# Altium schematic sheet mezza.SchDoc
size A1
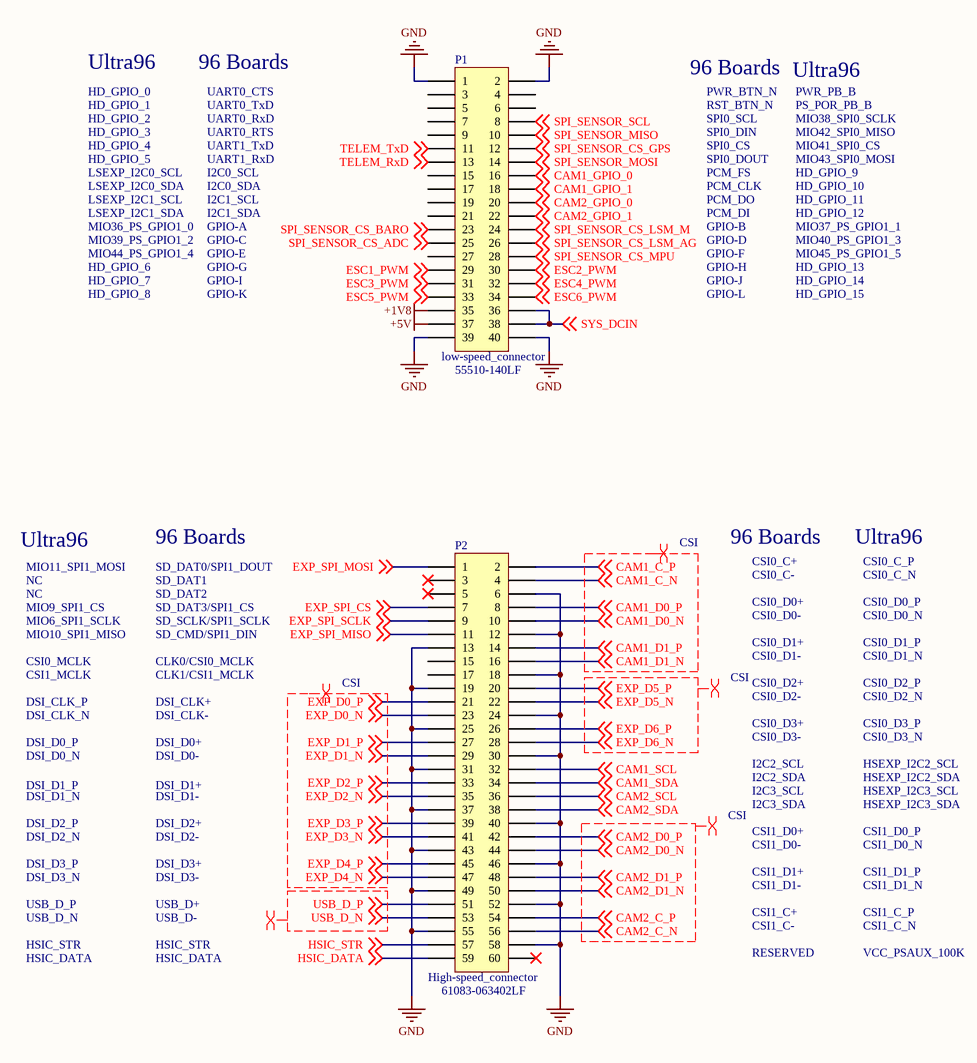
[diagram p0: mezza.SchDoc]

## Parts
P1  low-speed_connector  PartNumber: 55510-140LF  [low-speed_connector_SM]
P2  High-speed_connector  PartNumber: 61083-063402LF  [high-speed_connector]

## Nets
+1V8: P1.35
+5V: P1.37
GND: P1.1 P1.2 P1.39 P1.40 P2.6 P2.12 P2.13 P2.18 P2.19 P2.24 P2.25 P2.30 P2.31 P2.37 P2.40 P2.43 P2.46 P2.49 P2.52 P2.55 P2.58
CAM1_C_N: P2.4 ; off-sheet CAM1_C_N
CAM1_C_P: P2.2 ; off-sheet CAM1_C_P
CAM1_D0_N: P2.10 ; off-sheet CAM1_D0_N
CAM1_D0_P: P2.8 ; off-sheet CAM1_D0_P
CAM1_D1_N: P2.16 ; off-sheet CAM1_D1_N
CAM1_D1_P: P2.14 ; off-sheet CAM1_D1_P
CAM1_GPIO_0: P1.16 ; off-sheet CAM1_GPIO_0
CAM1_GPIO_1: P1.18 ; off-sheet CAM1_GPIO_1
CAM1_SCL: P2.32 ; off-sheet CAM1_SCL
CAM1_SDA: P2.34 ; off-sheet CAM1_SDA
CAM2_C_N: P2.56 ; off-sheet CAM2_C_N
CAM2_C_P: P2.54 ; off-sheet CAM2_C_P
CAM2_D0_N: P2.44 ; off-sheet CAM2_D0_N
CAM2_D0_P: P2.42 ; off-sheet CAM2_D0_P
CAM2_D1_N: P2.50 ; off-sheet CAM2_D1_N
CAM2_D1_P: P2.48 ; off-sheet CAM2_D1_P
CAM2_GPIO_0: P1.20 ; off-sheet CAM2_GPIO_0
CAM2_GPIO_1: P1.22 ; off-sheet CAM2_GPIO_1
CAM2_SCL: P2.36 ; off-sheet CAM2_SCL
CAM2_SDA: P2.38 ; off-sheet CAM2_SDA
ESC1_PWM: P1.29 ; off-sheet ESC1_PWM
ESC2_PWM: P1.30 ; off-sheet ESC2_PWM
ESC3_PWM: P1.31 ; off-sheet ESC3_PWM
ESC4_PWM: P1.32 ; off-sheet ESC4_PWM
ESC5_PWM: P1.33 ; off-sheet ESC5_PWM
ESC6_PWM: P1.34 ; off-sheet ESC6_PWM
EXP_D0_N: P2.23 ; off-sheet EXP_D0_N
EXP_D0_P: P2.21 ; off-sheet EXP_D0_P
EXP_D1_N: P2.29 ; off-sheet EXP_D1_N
EXP_D1_P: P2.27 ; off-sheet EXP_D1_P
EXP_D2_N: P2.35 ; off-sheet EXP_D2_N
EXP_D2_P: P2.33 ; off-sheet EXP_D2_P
EXP_D3_N: P2.41 ; off-sheet EXP_D3_N
EXP_D3_P: P2.39 ; off-sheet EXP_D3_P
EXP_D4_N: P2.47 ; off-sheet EXP_D4_N
EXP_D4_P: P2.45 ; off-sheet EXP_D4_P
EXP_D5_N: P2.22 ; off-sheet EXP_D5_N
EXP_D5_P: P2.20 ; off-sheet EXP_D5_P
EXP_D6_N: P2.28 ; off-sheet EXP_D6_N
EXP_D6_P: P2.26 ; off-sheet EXP_D6_P
EXP_SPI_CS: P2.7 ; off-sheet EXP_SPI_CS
EXP_SPI_MISO: P2.11 ; off-sheet EXP_SPI_MISO
EXP_SPI_MOSI: P2.1 ; off-sheet EXP_SPI_MOSI
EXP_SPI_SCLK: P2.9 ; off-sheet EXP_SPI_SCLK
HSIC_DATA: P2.59 ; off-sheet HSIC_DATA
HSIC_STR: P2.39(57) ; off-sheet HSIC_STR
SPI_SENSOR_CS_ADC: P1.25 ; off-sheet SPI_SENSOR_CS_ADC
SPI_SENSOR_CS_BARO: P1.23 ; off-sheet SPI_SENSOR_CS_BARO
SPI_SENSOR_CS_GPS: P1.12 ; off-sheet SPI_SENSOR_CS_GPS
SPI_SENSOR_CS_LSM_AG: P1.26 ; off-sheet SPI_SENSOR_CS_LSM_AG
SPI_SENSOR_CS_LSM_M: P1.24 ; off-sheet SPI_SENSOR_CS_LSM_M
SPI_SENSOR_CS_MPU: P1.28 ; off-sheet SPI_SENSOR_CS_MPU
SPI_SENSOR_MISO: P1.10 ; off-sheet SPI_SENSOR_MISO
SPI_SENSOR_MOSI: P1.14 ; off-sheet SPI_SENSOR_MOSI
SPI_SENSOR_SCL: P1.8 ; off-sheet SPI_SENSOR_SCL
SYS_DCIN: P1.36 P1.38 ; off-sheet SYS_DCIN
TELEM_RxD: P1.13 ; off-sheet TELEM_RxD
TELEM_TxD: P1.11 ; off-sheet TELEM_TxD
USB_D_N: P2.53 ; off-sheet USB_D_N
USB_D_P: P2.51 ; off-sheet USB_D_P

Not connected (* = marked no-connect by the designer): P1 3 4 5 6 7 9 15 17 19 21 27; P2 3* 5* 15 17

## Layout directives
differential pair; rule Differential Pairs Routing [Pref Gap = 0.15mm    Min Gap  = 0.1mm    Max Gap  = 0.254mmPref Width = 0.15mm    Min Width  = 0.1mm    Max Width  = 0.381mm]; differential pair class CSI: CAM1_C_N, CAM1_C_P, CAM1_D0_N, CAM1_D0_P, CAM1_D1_N, CAM1_D1_P, CAM2_C_N, CAM2_C_P, CAM2_D0_N, CAM2_D0_P, CAM2_D1_N, CAM2_D1_P, EXP_D0_N, EXP_D0_P, EXP_D1_N, EXP_D1_P, EXP_D2_N, EXP_D2_P, EXP_D3_N, EXP_D3_P, EXP_D4_N, EXP_D4_P, EXP_D5_N, EXP_D5_P, EXP_D6_N, EXP_D6_P
differential pair: USB_D_N, USB_D_P

## Notes on the sheet
- Ultra96
- 96 Boards
- HD_GPIO_0
- HD_GPIO_1
- HD_GPIO_2
- HD_GPIO_3
- HD_GPIO_4
- UART0_CTS
- UART0_TxD
- UART0_RxD
- UART0_RTS
- UART1_TxD
- PWR_BTN_N
- RST_BTN_N
- SPI0_SCL
- SPI0_DIN
- SPI0_CS
- PWR_PB_B
- PS_POR_PB_B
- MIO38_SPI0_SCLK
- MIO42_SPI0_MISO
- MIO41_SPI0_CS
- HD_GPIO_5
- LSEXP_I2C0_SCL
- LSEXP_I2C0_SDA
- LSEXP_I2C1_SCL
- LSEXP_I2C1_SDA
- UART1_RxD
- I2C0_SCL
- I2C0_SDA
- I2C1_SCL
- I2C1_SDA
- SPI0_DOUT
- PCM_FS
- PCM_CLK
- PCM_DO
- PCM_DI
- MIO43_SPI0_MOSI
- HD_GPIO_9
- HD_GPIO_10
- HD_GPIO_11
- HD_GPIO_12
- MIO36_PS_GPIO1_0
- MIO39_PS_GPIO1_2
- MIO44_PS_GPIO1_4
- HD_GPIO_6
- HD_GPIO_7
- GPIO-A
- GPIO-C
- GPIO-E
- GPIO-G
- GPIO-I
- GPIO-B
- GPIO-D
- GPIO-F
- GPIO-H
- GPIO-J
- MIO37_PS_GPIO1_1
- MIO40_PS_GPIO1_3
- MIO45_PS_GPIO1_5
- HD_GPIO_13
- HD_GPIO_14
- HD_GPIO_8
- GPIO-K
- GPIO-L
- HD_GPIO_15
- MIO11_SPI1_MOSI
- NC
- MIO9_SPI1_CS
- SD_DAT0/SPI1_DOUT
- SD_DAT1
- SD_DAT2
- SD_DAT3/SPI1_CS
- CSI0_C+
- CSI0_C-
- CSI0_D0+
- CSI0_D0-
- CSI0_C_P
- CSI0_C_N
- CSI0_D0_P
- CSI0_D0_N
- MIO6_SPI1_SCLK
- MIO10_SPI1_MISO
- CSI0_MCLK
- CSI1_MCLK
- SD_SCLK/SPI1_SCLK
- SD_CMD/SPI1_DIN
- CLK0/CSI0_MCLK
- CLK1/CSI1_MCLK
- CSI0_D1+
- CSI0_D1-
- CSI0_D2+
- CSI0_D1_P
- CSI0_D1_N
- CSI0_D2_P
- DSI_CLK_P
- DSI_CLK_N
- DSI_D0_P
- DSI_CLK+
- DSI_CLK-
- DSI_D0+
- CSI0_D2-
- CSI0_D3+
- CSI0_D3-
- CSI0_D2_N
- CSI0_D3_P
- CSI0_D3_N
- DSI_D0_N
- DSI_D1_P
- DSI_D1_N
- DSI_D0-
- DSI_D1+
- DSI_D1-
- I2C2_SCL
- I2C2_SDA
- I2C3_SCL
- I2C3_SDA
- HSEXP_I2C2_SCL
- HSEXP_I2C2_SDA
- HSEXP_I2C3_SCL
- HSEXP_I2C3_SDA
- DSI_D2_P
- DSI_D2_N
- DSI_D3_P
- DSI_D3_N
- DSI_D2+
- DSI_D2-
- DSI_D3+
- DSI_D3-
- CSI1_D0+
- CSI1_D0-
- CSI1_D1+
- CSI1_D1-
- CSI1_D0_P
- CSI1_D0_N
- CSI1_D1_P
- CSI1_D1_N
- USB_D_P
- USB_D_N
- HSIC_STR
- USB_D+
- USB_D-
- CSI1_C+
- CSI1_C-
- RESERVED
- CSI1_C_P
- CSI1_C_N
- VCC_PSAUX_100K
- HSIC_DATA

## Library data of the parts
P1 = low-speed_connector: Supplier 1: Digi-Key; Supplier Part Number 1: 609-2696-ND
P2 = High-speed_connector: Supplier 1: Digi-Key; Supplier Part Number 1: 609-1679-2-ND